# EAGLE design DIY-Cellphone (EAGLE 6.4)
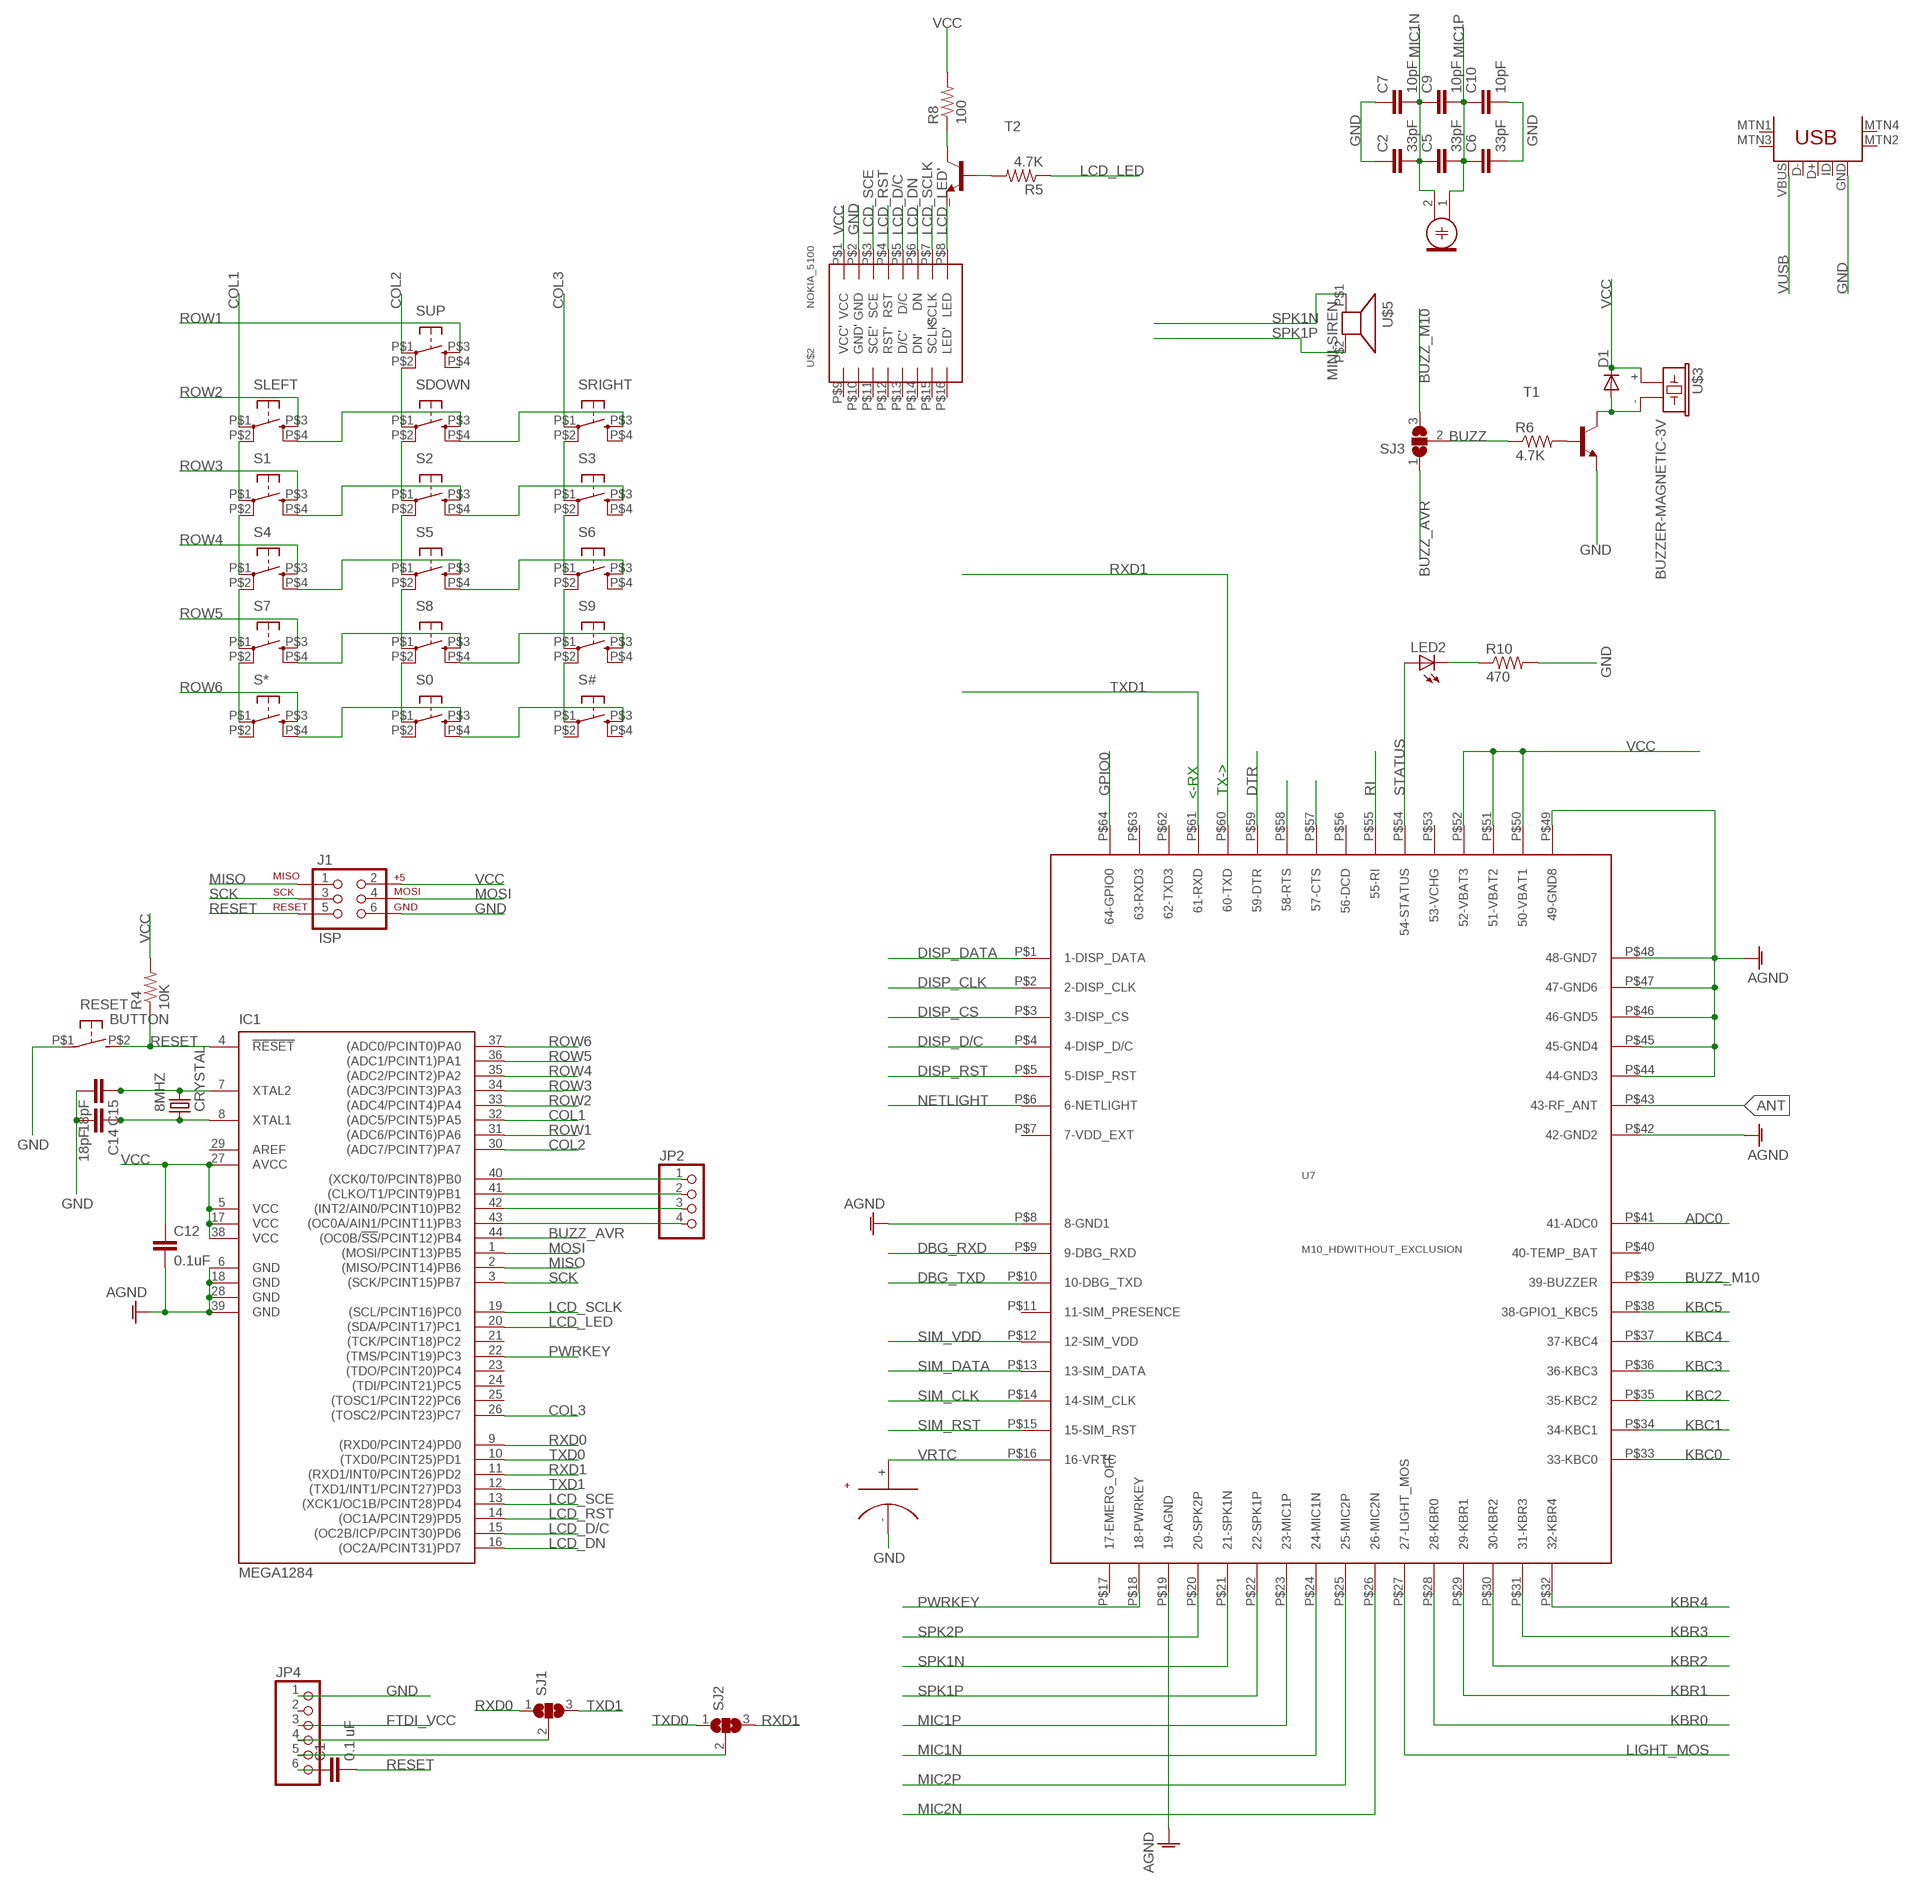
[diagram p0: schematic, sheet 1, part 1 of 2]
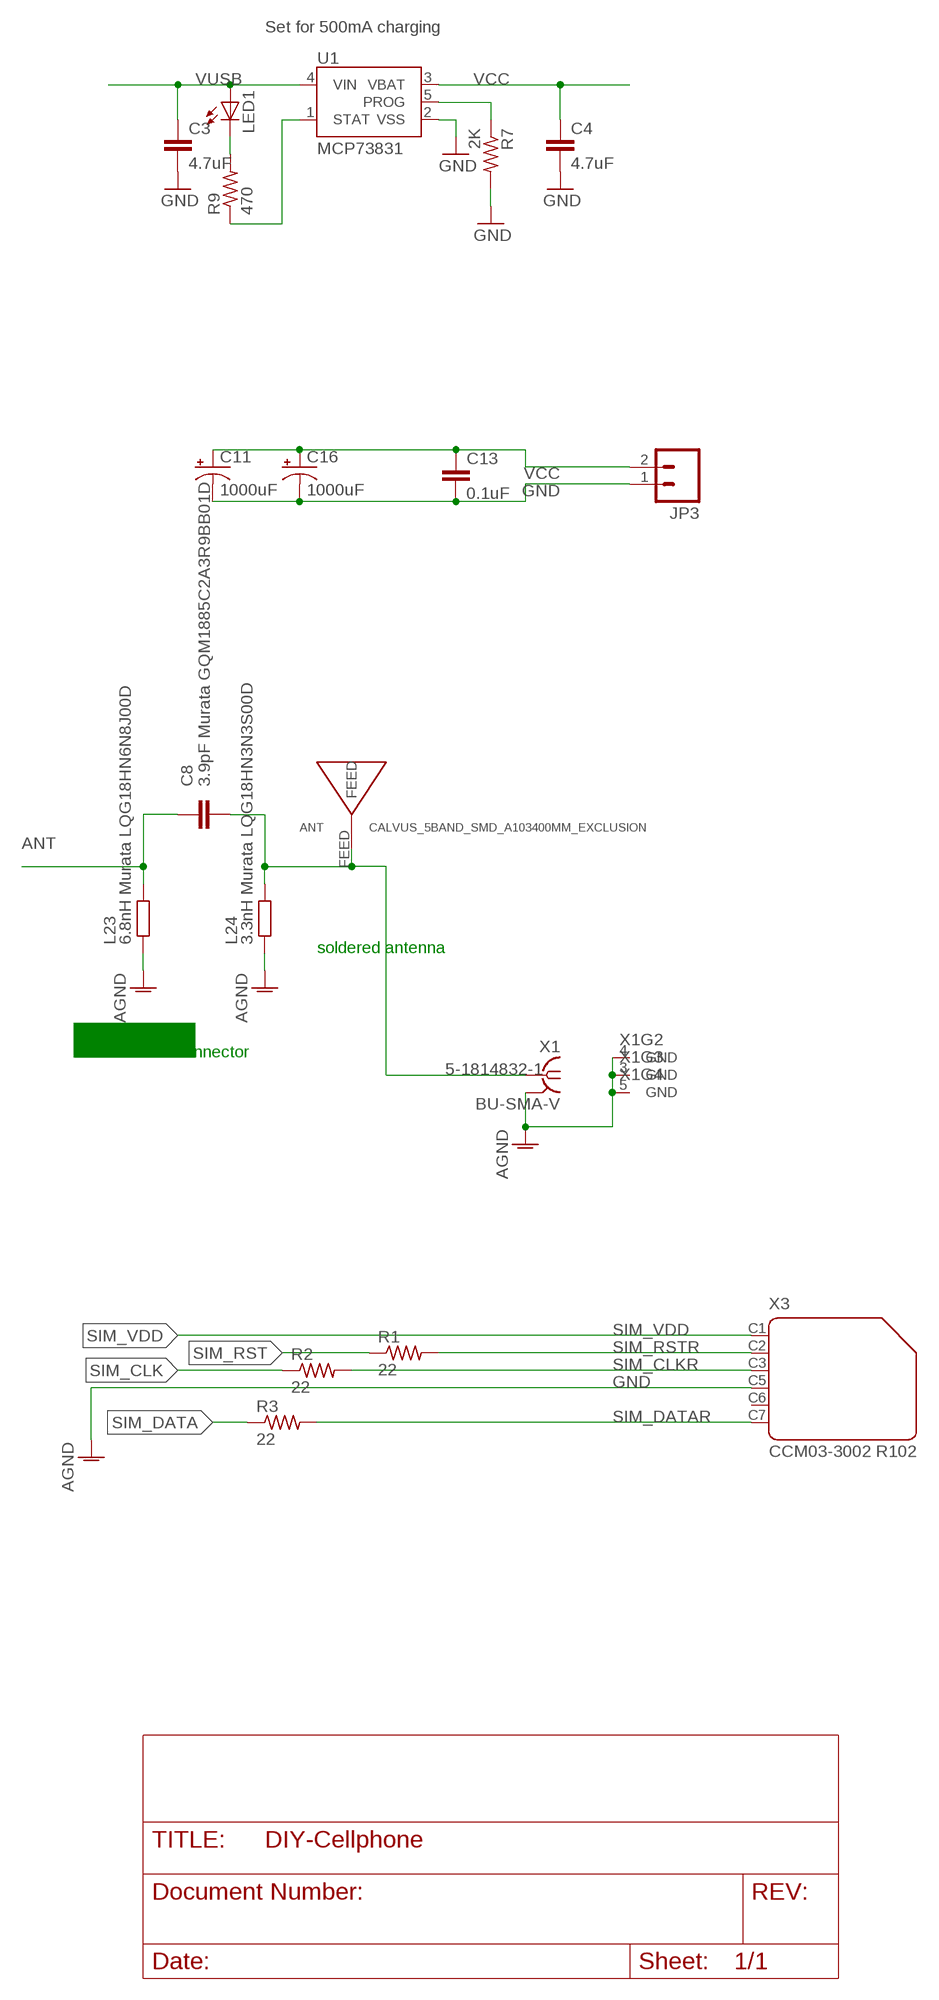
[diagram p1: schematic, sheet 1, part 2 of 2]

## Parts
8MHZ  CRYSTAL  [2-SMD-5X3MM]
ANT  CALVUS_5BAND_SMD_A103400MM_EXCLUSION  [CALVUS_5BAND_SMD_A10340_0MM_EXCLUSION]
C1  0.1 uF  C-EUC1206  [C1206]
C2  33pF  C-EUC1206  [C1206]
C3  4.7uF  C-EUC1206  [C1206]
C4  4.7uF  C-EUC1206  [C1206]
C5  33pF  C-EUC1206  [C1206]
C6  33pF  C-EUC1206  [C1206]
C7  10pF  C-EUC1206  [C1206]
C8  3.9pF Murata GQM1885C2A3R9BB01D  C-EU0603-RND  [C0603-ROUND]
C9  10pF  C-EUC1206  [C1206]
C10  10pF  C-EUC1206  [C1206]
C11  1000uF  CPOL-USD/7343-31R  [D/7343-31R]
C12  0.1uF  C-EUC1206  [C1206]
C13  0.1uF  C-EUC1206  [C1206]
C14  18pF  C-EUC1206  [C1206]
C15  18pF  C-EUC1206  [C1206]
C16  1000uF  CPOL-USD/7343-31R  [D/7343-31R]
D1  DIODE-SOD123  [SOD123]
IC1  MEGA1284  MEGA164P/324P/644P-AU  [TQFP44]
J1  ISP  AVR_SPI_PRG_6NS  [2X3-NS]
JP2  PINHD-1X4  [1X04]
JP3  M02-JST-2MM-SMT  [JST-2-SMD]
JP4  PINHD-1X6/90  [1X06/90]
L23  6.8nH Murata LQG18HN6N8J00D  R-EU_0603-RND  [R0603-ROUND]
L24  3.3nH Murata LQG18HN3N3S00D  R-EU_0603-RND  [R0603-ROUND]
LED1  LEDSMT1206  [1206]
LED2  LEDSMT1206  [1206]
MIC  ELECTRET_MICROPHON-WM-64PC/64PK  [WM-64PC/64PK]
R1  22  R-US_R1206  [R1206]
R2  22  R-US_R1206  [R1206]
R3  22  R-US_R1206  [R1206]
R4  10K  R-US_R1206  [R1206]
R5  4.7K  R-US_R1206  [R1206]
R6  4.7K  R-US_R1206  [R1206]
R7  2K  R-US_R1206  [R1206]
R8  100  R-US_R1206  [R1206]
R9  470  R-US_R1206  [R1206]
R10  470  R-US_R1206  [R1206]
RESET  BUTTON  BUTTON-2  [B3U-1000P]
S0  SWITCH-JLEAD  [BUTTON_6MM_JLEAD]
S1  SWITCH-JLEAD  [BUTTON_6MM_JLEAD]
S2  SWITCH-JLEAD  [BUTTON_6MM_JLEAD]
S3  SWITCH-JLEAD  [BUTTON_6MM_JLEAD]
S4  SWITCH-JLEAD  [BUTTON_6MM_JLEAD]
S5  SWITCH-JLEAD  [BUTTON_6MM_JLEAD]
S6  SWITCH-JLEAD  [BUTTON_6MM_JLEAD]
S7  SWITCH-JLEAD  [BUTTON_6MM_JLEAD]
S8  SWITCH-JLEAD  [BUTTON_6MM_JLEAD]
S9  SWITCH-JLEAD  [BUTTON_6MM_JLEAD]
S#  SWITCH-JLEAD  [BUTTON_6MM_JLEAD]
S*  SWITCH-JLEAD  [BUTTON_6MM_JLEAD]
SDOWN  SWITCH-JLEAD  [BUTTON_6MM_JLEAD]
SJ1  SJ2W  [SJ_2]
SJ2  SJ2W  [SJ_2]
SJ3  SJ2W  [SJ_2]
SLEFT  SWITCH-JLEAD  [BUTTON_6MM_JLEAD]
SRIGHT  SWITCH-JLEAD  [BUTTON_6MM_JLEAD]
SUP  SWITCH-JLEAD  [BUTTON_6MM_JLEAD]
T1  MMBT3904LT1-NPN-SOT23-BEC  [SOT23-BEC]
T2  MMBT3904LT1-NPN-SOT23-BEC  [SOT23-BEC]
U1  MCP73831  [SOT23-5]
U7  M10_HDWITHOUT_EXCLUSION  [M10_HD_WITHOUT_EXCLUSION]
U$1  USB-MINIB-5PIN  [USB-MINIB]
U$2  NOKIA_5100  [NOKIA_5100_SPARKFUN]
U$3  BUZZER-MAGNETIC-3V  [PUI-SMT-0540]
U$4  SUPERCAPPAS  [414-VA5R]
U$5  MINI-SIREN  [SPEAKER-6.4MM]
X1  BU-SMA-V  [BU-SMA-V]
X3  CCM03-3002 R102  CON-AMPHENOL_SIMLOCK-C707_10M006_512_2  [CON-AMPHENOL_C707_10M006_512_2]

## Nets
ADC0: U7.P$41(41-ADC0)
ANT [antenna]: C8.1 L23.2 U7.P$43(43-RF_ANT)
ANTENA [antenna]: ANT.FEED C8.2 L24.2 X1.1
BUZZ: R6.1 SJ3.2
BUZZ_AVR: IC1.44((OC0B/!SS!/PCINT12)PB4) SJ3.1
BUZZ_M10: SJ3.3 U7.P$39(39-BUZZER)
COL1: IC1.32((ADC5/PCINT5)PA5) SLEFT.P$1(P)
COL2: IC1.30((ADC7/PCINT7)PA7) SUP.P$1(P)
COL3: IC1.26((TOSC2/PCINT23)PC7) SRIGHT.P$1(P)
DBG_RXD: U7.P$9(9-DBG_RXD)
DBG_TXD: U7.P$10(10-DBG_TXD)
DISP_CLK: U7.P$2(2-DISP_CLK)
DISP_CS: U7.P$3(3-DISP_CS)
DISP_D/C: U7.P$4(4-DISP_D/C)
DISP_DATA: U7.P$1(1-DISP_DATA)
DISP_RST: U7.P$5(5-DISP_RST)
DTR: U7.P$59(59-DTR)
FTDI_VCC: JP4.3
GND [gnd]: C2.1 C3.2 C4.2 C6.2 C7.1 C10.2 C11.- C12.2 C13.2 C14.2 C15.2 C16.- IC1.6(GND) IC1.18(GND) IC1.28(GND) IC1.39(GND) J1.6 JP3.1 JP4.1 L23.1 L24.1 R7.2 R10.2 RESET.P$1(P) T1.E U1.2(VSS) U7.P$8(8-GND1) U7.P$19(19-AGND) U7.P$42(42-GND2) U7.P$44(44-GND3) U7.P$45(45-GND4) U7.P$46(46-GND5) U7.P$47(47-GND6) U7.P$48(48-GND7) U7.P$49(49-GND8) U$1.GND U$2.P$2(GND) U$4.- X1.2(GND) X1.3(GND) X1.4(GND) X1.5(GND) X3.C5 ; supply symbol labelled AGND
GPIO0: U7.P$64(64-GPIO0)
KBC0: U7.P$33(33-KBC0)
KBC1: U7.P$34(34-KBC1)
KBC2: U7.P$35(35-KBC2)
KBC3: U7.P$36(36-KBC3)
KBC4: U7.P$37(37-KBC4)
KBC5: U7.P$38(38-GPIO1_KBC5)
KBR0: U7.P$28(28-KBR0)
KBR1: U7.P$29(29-KBR1)
KBR2: U7.P$30(30-KBR2)
KBR3: U7.P$31(31-KBR3)
KBR4: U7.P$32(32-KBR4)
LCD_D/C: IC1.15((OC2B/ICP/PCINT30)PD6) U$2.P$5(D/C)
LCD_DN: IC1.16((OC2A/PCINT31)PD7) U$2.P$6(DN)
LCD_LED: IC1.20((SDA/PCINT17)PC1) R5.1
LCD_LED': T2.E U$2.P$8(LED)
LCD_RST: IC1.14((OC1A/PCINT29)PD5) U$2.P$4(RST)
LCD_SCE: IC1.13((XCK1/OC1B/PCINT28)PD4) U$2.P$3(SCE)
LCD_SCLK: IC1.19((SCL/PCINT16)PC0) U$2.P$7(SCLK)
LIGHT_MOS: U7.P$27(27-LIGHT_MOS)
MIC1N: C2.2 C5.1 C7.2 C9.1 MIC.2 U7.P$24(24-MIC1N)
MIC1P: C5.2 C6.1 C9.2 C10.1 MIC.1 U7.P$23(23-MIC1P)
MIC2N: U7.P$26(26-MIC2N)
MIC2P: U7.P$25(25-MIC2P)
MISO: IC1.2((MISO/PCINT14)PB6) J1.1
MOSI: IC1.1((MOSI/PCINT13)PB5) J1.4
N$1: U7.P$57(57-CTS)
N$2: R5.2 T2.B
N$3: R8.1 T2.C
N$4: D1.A T1.C U$3.-
N$5: C1.1 JP4.6
N$6: R6.2 T1.B
N$7: 8MHZ.P$2 C15.1 IC1.7(XTAL2)
N$8: 8MHZ.P$1 C14.1 IC1.8(XTAL1)
N$10: S1.P$1(P) SLEFT.P$2(P1)
N$11: S1.P$2(P1) S4.P$1(P)
N$12: S4.P$2(P1) S7.P$1(P)
N$13: JP4.4 SJ1.2
N$14: SDOWN.P$1(P) SUP.P$2(P1)
N$15: S2.P$1(P) SDOWN.P$2(P1)
N$16: S2.P$2(P1) S5.P$1(P)
N$17: S5.P$2(P1) S8.P$1(P)
N$18: JP4.5 SJ2.2
N$19: S3.P$1(P) SRIGHT.P$2(P1)
N$20: S3.P$2(P1) S6.P$1(P)
N$21: S6.P$2(P1) S9.P$1(P)
N$22: S0.P$4(S1) S#.P$3(S)
N$23: S0.P$3(S) S*.P$4(S1)
N$24: S7.P$4(S1) S8.P$3(S)
N$25: S8.P$4(S1) S9.P$3(S)
N$26: S4.P$4(S1) S5.P$3(S)
N$27: S5.P$4(S1) S6.P$3(S)
N$28: S1.P$4(S1) S2.P$3(S)
N$29: S2.P$4(S1) S3.P$3(S)
N$30: SDOWN.P$3(S) SLEFT.P$4(S1)
N$31: SDOWN.P$4(S1) SRIGHT.P$3(S)
N$32: S7.P$2(P1) S*.P$1(P)
N$33: S0.P$1(P) S8.P$2(P1)
N$34: S9.P$2(P1) S#.P$1(P)
N$35: R9.1 U1.1(STAT)
N$36: LED1.C R9.2
N$37: LED2.C R10.1
N$38: IC1.40((XCK0/T0/PCINT8)PB0) JP2.1
N$39: IC1.41((CLKO/T1/PCINT9)PB1) JP2.2
N$40: IC1.42((INT2/AIN0/PCINT10)PB2) JP2.3
N$41: IC1.43((OC0A/AIN1/PCINT11)PB3) JP2.4
N$43: U7.P$58(58-RTS)
NETLIGHT: U7.P$6(6-NETLIGHT)
PROG: R7.1 U1.5(PROG)
PWRKEY: IC1.22((TMS/PCINT19)PC3) U7.P$18(18-PWRKEY)
RESET: C1.2 IC1.4(!RESET) J1.5 R4.1 RESET.P$2(S)
RI: U7.P$55(55-RI)
ROW1: IC1.31((ADC6/PCINT6)PA6) SUP.P$3(S)
ROW2: IC1.33((ADC4/PCINT4)PA4) SLEFT.P$3(S)
ROW3: IC1.34((ADC3/PCINT3)PA3) S1.P$3(S)
ROW4: IC1.35((ADC2/PCINT2)PA2) S4.P$3(S)
ROW5: IC1.36((ADC1/PCINT1)PA1) S7.P$3(S)
ROW6: IC1.37((ADC0/PCINT0)PA0) S*.P$3(S)
RXD0: IC1.9((RXD0/PCINT24)PD0) SJ1.1
RXD1: IC1.11((RXD1/INT0/PCINT26)PD2) SJ2.3 U7.P$60(60-TXD)
SCK: IC1.3((SCK/PCINT15)PB7) J1.3
SIM_CLK: R2.1 U7.P$14(14-SIM_CLK)
SIM_CLKR: R2.2 X3.C3
SIM_DATA: R3.1 U7.P$13(13-SIM_DATA)
SIM_DATAR: R3.2 X3.C7
SIM_RST: R1.1 U7.P$15(15-SIM_RST)
SIM_RSTR: R1.2 X3.C2
SIM_VDD: U7.P$12(12-SIM_VDD) X3.C1
SPK1N: U7.P$21(21-SPK1N) U$5.P$1
SPK1P: U7.P$22(22-SPK1P) U$5.P$2
SPK2P: U7.P$20(20-SPK2P)
STATUS: LED2.A U7.P$54(54-STATUS)
TXD0: IC1.10((TXD0/PCINT25)PD1) SJ2.1
TXD1: IC1.12((TXD1/INT1/PCINT27)PD3) SJ1.3 U7.P$61(61-RXD)
VCC [power]: C4.1 C11.+ C12.1 C13.1 C16.+ D1.C IC1.5(VCC) IC1.17(VCC) IC1.27(AVCC) IC1.38(VCC) J1.2 JP3.2 R4.2 R8.2 U1.3(VBAT) U7.P$50(50-VBAT1) U7.P$51(51-VBAT2) U7.P$52(52-VBAT3) U$2.P$1(VCC) U$3.+
VRTC: U7.P$16(16-VRTC) U$4.+
VUSB: C3.1 LED1.A U1.4(VIN) U$1.VBUS
Unconnected: IC1.21((TCK/PCINT18)PC2) IC1.23((TDO/PCINT20)PC4) IC1.24((TDI/PCINT21)PC5) IC1.25((TOSC1/PCINT22)PC6) JP4.2 S0.P$2(P1) S3.P$4(S1) S6.P$4(S1) S9.P$4(S1) S#.P$2(P1) S#.P$4(S1) S*.P$2(P1) SRIGHT.P$4(S1) SUP.P$4(S1) U7.P$7(7-VDD_EXT) U7.P$11(11-SIM_PRESENCE) U7.P$17(17-EMERG_OFF) U7.P$40(40-TEMP_BAT) U7.P$53(53-VCHG) U7.P$56(56-DCD) U7.P$62(62-TXD3) U7.P$63(63-RXD3) U$1.D+ U$1.D- U$1.ID U$1.MTN1(MTN2) U$1.MTN2(MTN3) U$1.MTN3(MTN1) U$1.MTN4 U$2.P$9(VCC') U$2.P$10(GND') U$2.P$11(SCE') U$2.P$12(RST') U$2.P$13(D/C') U$2.P$14(DN') U$2.P$15(SCLK') U$2.P$16(LED') X3.C6

## Notes on the sheet
- Set for 500mA charging
- <-RX
- TX->
- soldered antenna
- SMA or U.FL connector

## Power pins joined to a net without a drawn wire
AREF: IC1.29(AREF)

## Library data of the parts
8MHZ = fab:CRYSTAL
ANT = SmartPrj:CALVUS_5BAND_SMD_A10340
C1-C7 C9 C10 C12-C15 = cellphone-rcl:C-EU: CAPACITOR, European symbol
C8 = SmartPrj:C-EU: CAPACITOR, European symbol
C11 C16 = cellphone-rcl:CPOL-US: POLARIZED CAPACITOR, American symbol
D1 = cellphone-diode:DIODE-: DIODE
IC1 = avr-5:MEGA164P/324P/644P-AU
J1 = SparkFun-Connectors:AVR_SPI_PRG_6: AVR ISP 6 Pin This is the reduced ISP connector for AVR programming. Common on Arduino. This footprint will take up less PCB space and can be used with a 10-pin to 6-pin adapter such as SKU: BOB-08508
JP2 = pinhead:PINHD-1X4: PIN HEADER
JP3 = SparkFun-Connectors:M02: Header 2 Standard 2-pin 0.1" header. Use with straight break away headers (SKU : PRT-00116), right angle break away headers (PRT-00553), swiss pins (PRT-00743), machine pins (PRT-00117), and female headers (PRT-00115). Molex polarized connector foot print use with SKU : PRT-08233 with associated crimp pins and housings.
JP4 = pinhead:PINHD-1X6: PIN HEADER
L23 L24 = SmartPrj:R-EU_: RESISTOR, European symbol
LED1 LED2 = cellphone-led:LED: LED OSRAM: - CHIPLED LG R971, LG N971, LY N971, LG Q971, LY Q971, LO R971, LY R971 LH N974, LH R974 LS Q976, LO Q976, LY Q976 LO Q996 - Hyper CHIPLED LW Q18S LB Q993, LB Q99A, LB R99A - SideLED LS A670, LO A670, LY A670, LG A670, LP A670 LB A673, LV A673, LT A673, LW A673 LH A674 LY A675 LS A676, LA A676, LO A676, LY A676, LW A676 LS A679, LY A679, LG A679 - Hyper Micro SIDELED® LS Y876, LA Y876, LO Y876, LY Y876 LT Y87S - SmartLED LW L88C, LW L88S LB L89C, LB L89S, LG L890 LS L89K, LO L89K, LY L89K LS L896, LA L896, LO L896, LY L896 - TOPLED LS T670, LO T670, LY T670, LG T670, LP T670 LSG T670, LSP T670, LSY T670, LOP T670, LYG T670 LG T671, LOG T671, LSG T671 LB T673, LV T673, LT T673, LW T673 LH T674 LS T676, LA T676, LO T676, LY T676, LB T676, LH T676, LSB T676, LW T676 LB T67C, LV T67C, LT T67C, LS T67K, LO T67K, LY T67K, LW E67C LS E67B, LA E67B, LO E67B, LY E67B, LB E67C, LV E67C, LT E67C LW T67C LS T679, LY T679, LG T679 LS T770, LO T770, LY T770, LG T770, LP T770 LB T773, LV T773, LT T773, LW T773 LH T774 LS E675, LA E675, LY E675, LS T675 LS T776, LA T776, LO T776, LY T776, LB T776 LHGB T686 LT T68C, LB T68C - Hyper Mini TOPLED® LB M676 - Mini TOPLED Santana® LG M470 LS M47K, LO M47K, LY M47K Source: http://www.osram.convergy.de LUXEON: - LUMILED® LXK2-PW12-R00, LXK2-PW12-S00, LXK2-PW14-U00, LXK2-PW14-V00 LXK2-PM12-R00, LXK2-PM12-S00, LXK2-PM14-U00 LXK2-PE12-Q00, LXK2-PE12-R00, LXK2-PE12-S00, LXK2-PE14-T00, LXK2-PE14-U00 LXK2-PB12-K00, LXK2-PB12-L00, LXK2-PB12-M00, LXK2-PB14-N00, LXK2-PB14-P00, LXK2-PB14-Q00 LXK2-PR12-L00, LXK2-PR12-M00, LXK2-PR14-Q00, LXK2-PR14-R00 LXK2-PD12-Q00, LXK2-PD12-R00, LXK2-PD12-S00 LXK2-PH12-R00, LXK2-PH12-S00 LXK2-PL12-P00, LXK2-PL12-Q00, LXK2-PL12-R00 Source: www.luxeon.com KINGBRIGHT: KA-3528ASYC Source: www.kingbright.com
MIC = microphon:ELECTRET_MICROPHON-: Electret Condenser Microphone
R1-R10 = cellphone-rcl:R-US_: RESISTOR, American symbol
RESET = cellphone:BUTTON-2
S0 S1-S9 S# S* SDOWN SLEFT SRIGHT SUP = cellphone:SWITCH-JLEAD: Digikey #EG4374CT-ND. SWITCH TACTILE SPST-NO 0.05A 12V. 6.00mm x 6.00mm.
SJ1-SJ3 = jumper:SJ2W: SMD solder JUMPER
T1 T2 = transistor:*-NPN-: NPN Transistror BF959 corrected 2008.03.06
U1 = SparkFun:MCP73831: Microchip's MCP73831 Miniature single cell, fully integrated Li-Ion, Li-polymer charge management controller http://ww1.microchip.com/downloads/en/DeviceDoc/21984a.pdf
U7 = GSM:M10_HD
U$1 = SparkFun-Connectors:USB-MINIB: Mini-USB "B" connector with 5th pin broken out. Created new symbol breaking out 5th "ID" pin in mini/micro USB connector spec. See: http://en.wikipedia.org/wiki/Mini_usb#Cables. Uses same footprint as 4-pin symbol. Also added pins to connect to mounting / shield pads if required (probably not generally needed as signals aren't shielded once they leave the connector).
U$2 = cellphone:NOKIA_5100
U$3 = cellphone:BUZZER-MAGNETIC-3V
U$4 = cellphone:SUPERCAP
U$5 = cellphone:MINI-SIREN
X1 = con-coax:BU-SMA-V: FEMALE SMA CONNECTOR Radiall distributor RS 112-3794; PN: 5-1814832-1
X3 = SmartPrj:CON-AMPHENOL_SIMLOCK-C707_10M006_512_2: C707A SIMLOCK® 2.5 mm with wide solder tails Source: Data sheet <http://www.amphenol.info/downloads/C707_10M006_512_2.pdf>; OC_FARNELL: 1463072; OC_NEWARK: unknown

## Net classes
1 power: width 0.254 mm, drill 0.406 mm, clearance 0.178 mm
2 gnd: width 0.254 mm, drill 0.406 mm, clearance 0.178 mm
3 power usb: width 0.254 mm, drill 0.406 mm, clearance 0.178 mm
4 antenna: clearance 0.61 mm

## Board
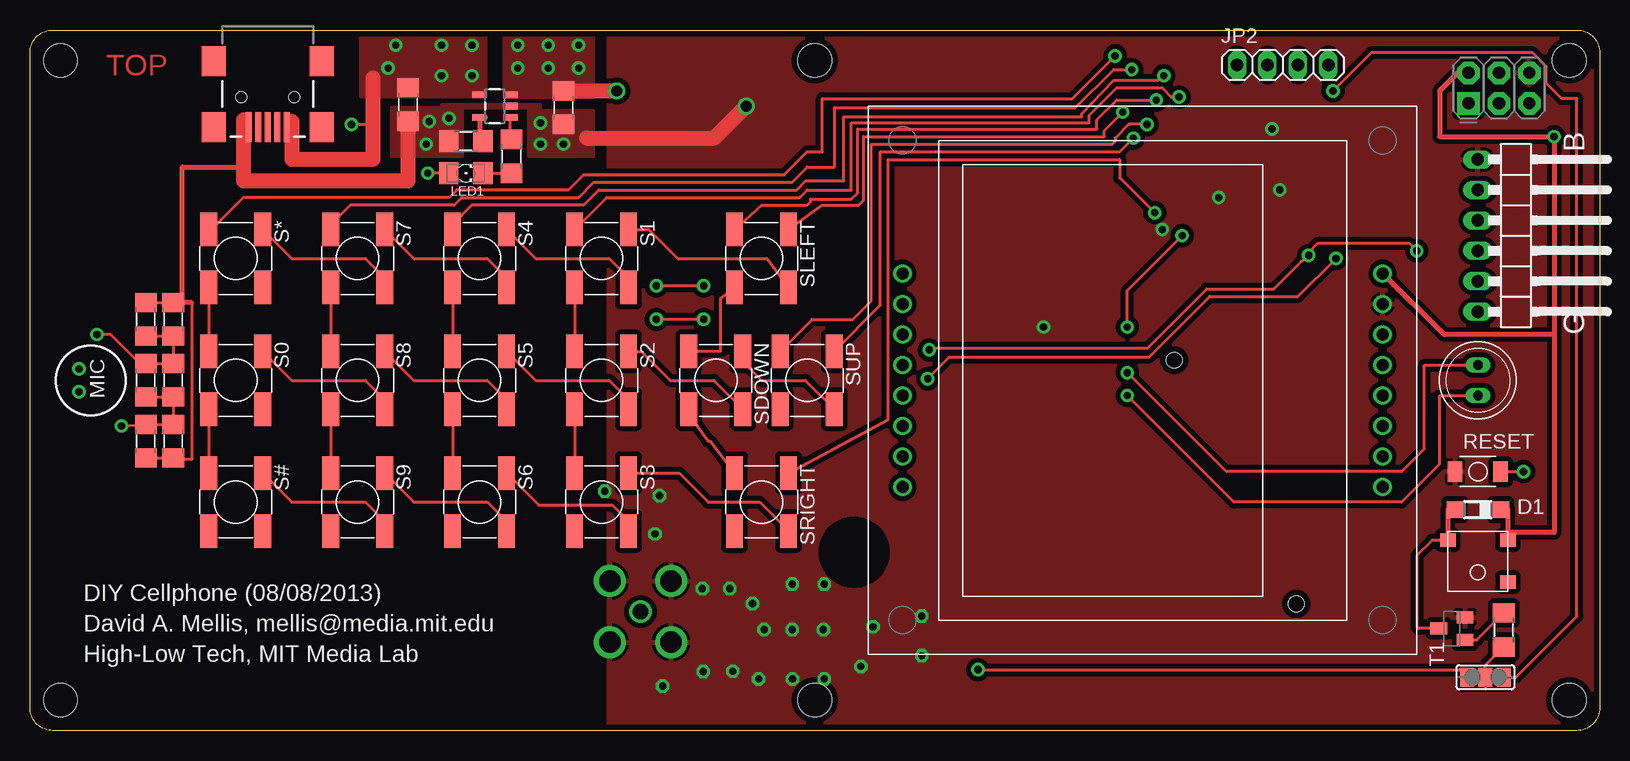
[diagram p2: board, top side]
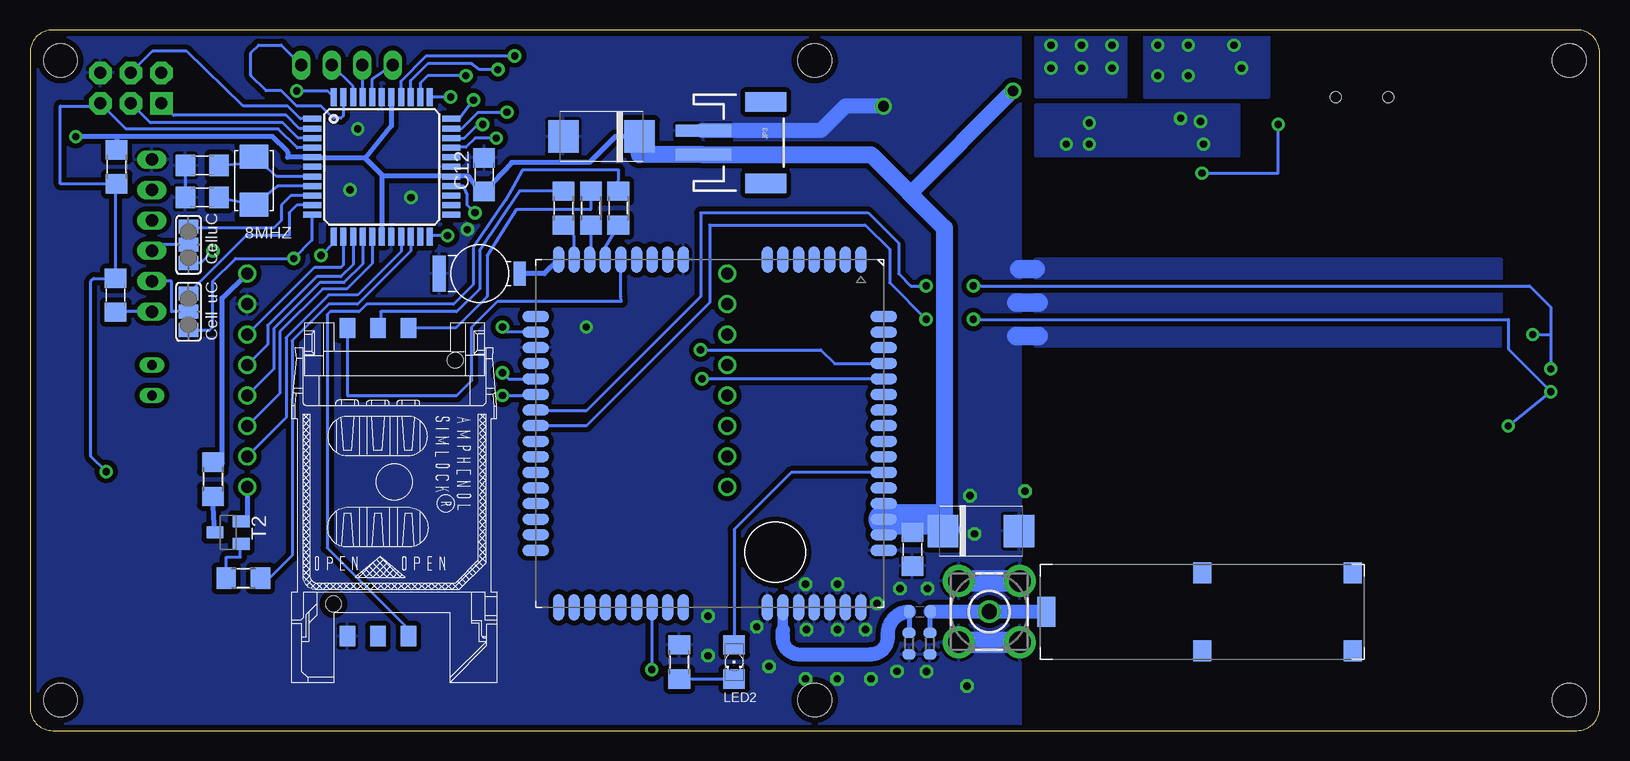
[diagram p3: board, bottom side, seen from below]

Size 130.81 x 58.42 mm. Coordinates in mm from the lower left corner, seen from the top.
Outline: 130.81,56.52 130.81,1.91 arc-90 128.91,0 1.91,0 arc-90 0,1.91 0,56.52 arc-90 1.91,58.42 128.91,58.42 arc-90 130.81,56.52
Copper layers (1*16): Top 0.035mm / dielectric 1.5mm / Bottom 0.035mm
Design rules "default": minimum track width 10mil, minimum drill 22mil, track to track 8mil, track to pad 8mil, pad to pad 8mil, via to via 8mil, smd to smd 8mil, copper to edge 20mil, drill to drill 12mil, minimum pad ring 10mil, minimum via ring 10mil, stop-mask expansion 1mil, vias tented up to drill 30mil, thermal gap 10mil
Holes 2.8 mm at 2.54,55.88 2.54,2.54 128.27,2.54 128.27,55.88 65.41,55.88 65.41,2.54

### Footprints (pad centres in the part's own frame; a part is rotated, then mirrored left to right if it is on the bottom)
2-SMD-5X3MM = smd 2 x 2.4: P$1 -2,0; P$2 2,0
CALVUS_5BAND_SMD_A10340_0MM_EXCLUSION = smd 2.5 x 1.5: FEED 3.95,0.5 | smd 1.75 x 1.5: FIXINGPOINT$1 0.7,26.05; FIXINGPOINT$2 7.22,26.05; FIXINGPOINT$3 0.7,13.49; FIXINGPOINT$4 7.22,13.49
C1206 = smd 1.6 x 1.8: 1 -1.4,0; 2 1.4,0
C0603-ROUND = smd 0.898 x 1.1: 1 -0.889,0; 2 0.889,0
D/7343-31R = smd 2.55 x 2.7: + 3.175,0; - -3.175,0
SOD123 = smd 1.4 x 1.4: A 1.9,0; C -1.9,0
TQFP44 = smd 1.5 x 0.5: 1 -5.8,4; 2 -5.8,3.2; 3 -5.8,2.4; 4 -5.8,1.6; 5 -5.8,0.8; 6 -5.8,0; 7 -5.8,-0.8; 8 -5.8,-1.6; 9 -5.8,-2.4; 10 -5.8,-3.2; 11 -5.8,-4; 23 5.8,-4; 24 5.8,-3.2; 25 5.8,-2.4; 26 5.8,-1.6; 27 5.8,-0.8; 28 5.8,0; 29 5.8,0.8; 30 5.8,1.6; 31 5.8,2.4; 32 5.8,3.2; 33 5.8,4 | smd 0.5 x 1.5: 12 -4,-5.8; 13 -3.2,-5.8; 14 -2.4,-5.8; 15 -1.6,-5.8; 16 -0.8,-5.8; 17 0,-5.8; 18 0.8,-5.8; 19 1.6,-5.8; 20 2.4,-5.8; 21 3.2,-5.8; 22 4,-5.8; 34 4,5.8; 35 3.2,5.8; 36 2.4,5.8; 37 1.6,5.8; 38 0.8,5.8; 39 0,5.8; 40 -0.8,5.8; 41 -1.6,5.8; 42 -2.4,5.8; 43 -3.2,5.8; 44 -4,5.8
2X3-NS = drill 1.016 pad 1.88 square: 1 -2.54,-1.27 | drill 1.016 pad 1.88 octagon: 2 -2.54,1.27; 3 0,-1.27; 4 0,1.27; 5 2.54,-1.27; 6 2.54,1.27
1X04 = drill 1.016 long: 1 -3.81,0; 2 -1.27,0; 3 1.27,0; 4 3.81,0
JST-2-SMD = smd 1 x 4.6: 1 -1,-3.7; 2 1,-3.7 | smd 1.6 x 3.4: NC1 -3.4,1.5; NC2 3.4,1.5
1X06/90 = drill 1.016 long: 1 -6.35,-3.81; 2 -3.81,-3.81; 3 -1.27,-3.81; 4 1.27,-3.81; 5 3.81,-3.81; 6 6.35,-3.81
R0603-ROUND = smd 0.898 x 1.1: 1 -0.889,0; 2 0.889,0
1206 = smd 1.6 x 1.803: A -1.422,0; C 1.422,0
WM-64PC/64PK = drill 0.6 pad 1: 1 -1,0.95; 2 -1,-0.95
R1206 = smd 1.6 x 1.803: 1 -1.422,0; 2 1.422,0
B3U-1000P = smd 1.2 x 1.7: P$1 -1.9,0; P$2 1.9,0
BUTTON_6MM_JLEAD = smd 2.794 x 1.4: P$1 -2.413,2.25; P$2 2.413,2.25; P$3 -2.413,-2.25; P$4 2.413,-2.25
SJ_2 = smd 1.168 x 1.6: 1 -1.524,0; 2 0,0; 3 1.524,0
SOT23-BEC = smd 1 x 1.4: B -0.95,-1.1; C 0,1.1; E 0.95,-1.1
SOT23-5 = smd 0.55 x 1.2: 1 -0.95,-1.3; 2 0,-1.3; 3 0.95,-1.3; 4 0.95,1.3; 5 -0.95,1.3
M10_HD_WITHOUT_EXCLUSION = smd 2.2 x 0.9: P$1 0,27.1; P$2 0,25.8; P$3 0,24.5; P$4 0,23.2; P$5 0,21.9; P$6 0,20.6; P$7 0,19.3; P$8 0,12.3; P$9 0,11; P$10 0,9.7; P$11 0,8.4; P$12 0,7.1; P$13 0,5.8; P$14 0,4.5; P$15 0,3.2; P$16 0,1.9; P$33 29,1.9; P$34 29,3.2; P$35 29,4.5; P$36 29,5.8; P$37 29,7.1; P$38 29,8.4; P$39 29,9.7; P$40 29,11; P$41 29,12.3; P$42 29,19.3; P$43 29,20.6; P$44 29,21.9; P$45 29,23.2; P$46 29,24.5; P$47 29,25.8; P$48 29,27.1 | smd 0.9 x 2.2: P$17 4.75,0; P$18 6.05,0; P$19 7.35,0; P$20 8.65,0; P$21 9.95,0; P$22 11.25,0; P$23 12.55,0; P$24 13.85,0; P$25 15.15,0; P$26 16.45,0; P$27 17.75,0; P$28 19.05,0; P$29 20.35,0; P$30 21.65,0; P$31 22.95,0; P$32 24.25,0; P$49 24.25,29; P$50 22.95,29; P$51 21.65,29; P$52 20.35,29; P$53 19.05,29; P$54 17.75,29; P$55 16.45,29; P$56 15.15,29; P$57 13.85,29; P$58 12.55,29; P$59 11.25,29; P$60 9.95,29; P$61 8.65,29; P$62 7.35,29; P$63 6.05,29; P$64 4.75,29
USB-MINIB = smd 2.5 x 0.5: D+ 2.5,0; D- 2.5,0.8; GND 2.5,-1.6; ID 2.5,-0.8; VBUS 2.5,1.6 | smd 2.5 x 2: MTN1 -3,4.5; MTN2 2.5,4.5; MTN3 -3,-4.5; MTN4 2.5,-4.5 | hole 0.9: 0,2.2; 0,-2.2
NOKIA_5100_SPARKFUN = drill 1: P$1 -8.89,20; P$2 -6.35,20; P$3 -3.81,20; P$4 -1.27,20; P$5 1.27,20; P$6 3.81,20; P$7 6.35,20; P$8 8.89,20; P$9 -8.89,-20; P$10 -6.35,-20; P$11 -3.81,-20; P$12 -1.27,-20; P$13 1.27,-20; P$14 3.81,-20; P$15 6.35,-20; P$16 8.89,-20
PUI-SMT-0540 = smd 1.3 x 1.1: + -2.5,0; - 2.5,0; DUMMY -2.5,3.5
414-VA5R = smd 1 x 2: + -3.35,0 | smd 1.1 x 3: - 3.35,0
SPEAKER-6.4MM = drill 0.8 long: P$1 -1.27,0; P$2 1.27,0
BU-SMA-V = drill 1.27: 1 0,0 | drill 1.778: 2 -2.55,2.55; 3 2.55,2.55; 4 2.55,-2.55; 5 -2.55,-2.55
CON-AMPHENOL_C707_10M006_512_2 = smd 1.7 x 1.3: C1 -12.85,-3.915; C2 -12.85,-1.375; C3 -12.85,1.165; C5 12.85,-3.915; C6 12.85,-1.375; C7 12.85,1.165 | hole 1.3: 10.16,-5.08; -10.16,5.08

### Placement (x,y rotation side)
8MHZ  112.14,45.85 90 bottom
ANT  46.63,13.86 270 bottom
C1  123.68,36.31 90 bottom
C2  9.65,24.13 90 top
C3  31.5,52.2 270 top
C4  44.45,51.94 270 top
C5  9.65,29.21 90 top
C6  9.65,34.29 90 top
C7  11.94,24.13 90 top
C8  56.66,9.92 0 bottom
C9  11.94,29.21 90 top
C10  11.94,34.29 90 top
C11  83.19,49.53 0 bottom
C12  92.96,46.35 90 bottom
C13  57.28,15.11 270 bottom
C14  116.46,44.45 180 bottom
C15  116.46,47.12 180 bottom
C16  51.56,16.64 180 bottom
D1  120.65,18.41 180 top
IC1  101.49,47.01 0 bottom
J1  122.41,53.58 0 top
JP2  104.39,55.5 0 top
JP3  70.99,49.02 270 bottom
JP4  124.46,41.27 270 top
L23  57.55,7.25 90 bottom
L24  55.82,7.25 90 bottom
LED1  36.32,46.48 0 top
LED2  72.14,5.71 270 bottom
MIC  5.08,29.21 0 top
R1  86.36,43.56 90 bottom
R2  84.07,43.56 90 bottom
R3  81.79,43.56 90 bottom
R4  123.59,47.01 90 bottom
R5  113.03,12.7 180 bottom
R6  122.81,8.38 90 top
R7  36.32,49.15 180 top
R8  115.57,20.95 90 bottom
R9  40.13,47.88 270 top
R10  76.71,5.71 90 bottom
RESET  120.65,21.59 0 top
S0  17.14,29.21 270 top
S1  47.62,39.37 270 top
S2  47.62,29.21 270 top
S3  47.62,19.05 270 top
S4  37.47,39.37 270 top
S5  37.47,29.21 270 top
S6  37.47,19.05 270 top
S7  27.3,39.37 270 top
S8  27.3,29.21 270 top
S9  27.3,19.05 270 top
S#  17.14,19.05 270 top
S*  17.14,39.37 270 top
SDOWN  57.15,29.21 270 top
SJ1  117.6,40.51 270 bottom
SJ2  117.6,34.92 270 bottom
SJ3  121.28,4.45 180 top
SLEFT  60.96,39.37 270 top
SRIGHT  60.96,19.05 270 top
SUP  64.77,29.21 270 top
T1  118.49,8.51 90 top
T2  114.3,16.51 90 bottom
U1  38.73,52.07 90 top
U7  88.67,39.27 270 bottom
U$1  19.81,52.83 270 top
U$2  92.71,29.21 270 top
U$3  120.65,15.88 180 top
U$4  93.34,38.1 180 bottom
U$5  120.65,29.21 270 top
X1  50.87,9.92 0 bottom
X3  100.44,20.72 270 bottom

### Tracks (layer width: path | path; a pad name or v marks a point on that pad's centre or on a via)
ANT
  Bottom 0.406: C8.1 L23.2
  Bottom 0.889: 68.06,8.4 U7.P$43
  Bottom 1.168: 68.06,8.4 68.06,7.89 arc-90 66.92,6.37 60.73,6.37 arc-90 59.33,7.76 59.33,8.02 arc90 C8.1
ANTENA
  Bottom 0.406: 55.52,9.71 C8.2 55.77,8.14 L24.2
  Bottom 1.168: ANT.FEED arc-90 46.27,9.92 X1.1 C8.2
BUZZ
  Top 0.254: SJ3.2 121.28,5.44 R6.1
BUZZ_AVR  (via drill 0.6)
  Top 0.254: v108.58,53.34 111.76,56.52 125.22,56.52 126.36,55.37 126.36,53.98 127.64,52.7 128.91,52.7 128.91,9.53 123.83,4.45 SJ3.1
  Bottom 0.254: v108.58,53.34 106.03,53.34 IC1.44
BUZZ_M10  (via drill 0.6)
  Top 0.254: v78.99,5.08 119.13,5.08 SJ3.3
  Bottom 0.254: U7.P$39 78.99,10.27 v78.99,5.08
COL1  (via drill 0.6)
  Top 0.254: SLEFT.P$1 66.04,43.81 69.05,43.81 69.47,44.23 69.47,49.53 89.53,49.53 89.53,50.04 v91.06,51.56
  Bottom 0.254: IC1.32 94.83,50.21 93.47,51.56 v91.06,51.56
COL2  (via drill 0.6)
  Top 0.254: SUP.P$1 70.87,35.47 70.87,48.26 90.81,48.26 v91.95,49.4
  Bottom 0.254: v91.95,49.4 93.73,49.4 94.49,48.64 95.63,48.64 95.67,48.61 IC1.30
COL3  (via drill 0.6)
  Top 0.254: SRIGHT.P$1 71.5,25.94 71.5,47.62 90.81,47.62 90.81,46.1 v93.73,43.18
  Bottom 0.254: v93.73,43.18 94.36,43.81 94.36,44.7 94.68,45.41 IC1.26
GND  (via drill 0.6, 0.61, 0.9)
  Top 0.254: C2.1 C7.1 11.94,22.61 13.46,22.61 13.46,35.69 C10.2 C6.2 | U$1.GND 17.78,50.93
  Top 0.406: 13.46,35.69 12.7,35.69 12.7,46.99 17.7,46.99 17.78,50.93
  Top 1.27: 17.78,50.93 17.78,45.85 31.5,45.85 C3.2 | 46.35,49.4 57.02,49.4 v59.69,52.07
  Bottom 0.254: C15.2 C14.2
  Bottom 1.27: v59.69,52.07 62.87,52.07 64.9,50.04 74.8,50.04
  Bottom 1.524: 46.99,38.48 48.39,38.48 | 46.74,35.69 48.64,35.69 | 46.74,32.89 48.64,32.89
  Bottom 1.778: X1.5 X1.4 | X1.2 X1.3
  other vias: 66.11,8.42 63.52,8.42 60.22,10.58 61.18,8.42 66.19,4.31 63.54,4.31 60.73,4.31 58.57,4.94 70.25,8.65 69.23,5.35 58.31,11.83 52.72,3.7 56.1,4.92 52.09,16.4 74.31,6.24 74.31,9.54 66.19,12.21 63.52,12.21 56.03,11.83 52.47,19.57 47.9,19.95 99.06,44.45 103.5,50.16 104.14,45.09 94.36,41.78 84.45,33.66 33.27,50.8 34.92,51.05 33.02,48.9 42.55,48.9 42.55,50.67 44.45,48.9
  pour Bottom (isolate 0.406): 130.81,58.42 130.81,0 48.26,0 48.26,58.42
  pour Top (isolate 0.406): 48.26,58.42 130.81,58.42 130.81,0 48.26,0
  pour Bottom (isolate 0.406): 8.26,36.45 46.99,36.45 46.99,34.92 8.26,34.92
  pour Bottom (isolate 0.406): 8.26,33.66 46.99,33.66 46.99,32.13 8.26,32.13
  pour Bottom (isolate 0.406): 8.26,39.24 46.99,39.24 46.99,37.72 8.26,37.72
  pour Top (no thermals): 36.07,51.94 41.53,51.94 41.53,47.88 46.99,47.88 46.99,51.69 42.55,51.69 42.55,52.2 34.29,52.2 34.29,51.94 30.1,51.94 30.1,47.88 36.07,47.88
  pour Bottom: 30.1,47.88 46.99,47.88 46.99,52.2 30.1,52.2
LCD_D/C
  Bottom 0.254: IC1.15 103.09,38.89 104.65,37.34 106.68,37.34 110.49,33.53 110.49,30.16 U$2.P$5
LCD_DN
  Bottom 0.254: IC1.16 102.29,38.93 104.39,36.83 106.43,36.83 109.98,33.27 109.98,28.13 U$2.P$6
LCD_LED
  Bottom 0.254: IC1.20 99.09,39.97 103.5,35.56 105.92,35.56 108.97,32.51 108.97,14.61 110.87,12.7 R5.1
LCD_LED'
  Bottom 0.254: 112.71,17.46 T2.E
  Bottom 0.406: U$2.P$8 112.71,17.46
LCD_RST
  Bottom 0.254: IC1.14 103.89,38.86 104.9,37.85 106.93,37.85 111,33.78 111,32.19 U$2.P$4
LCD_SCE
  Bottom 0.254: IC1.13 104.69,38.82 104.9,38.61 107.12,38.61 U$2.P$3
LCD_SCLK
  Bottom 0.254: IC1.19 99.89,39.94 103.5,36.32 105.92,36.32 109.47,32.77 109.47,26.1 U$2.P$7
MIC1N  (via drill 0.6)
  Top 0.254: C5.1 C9.1 C7.2 C2.2 v7.62,25.4 | v56.13,34.29 v52.2,34.29
  Bottom 0.254: v56.13,34.29 59.18,37.34 59.18,40.13 61.21,42.16 74.17,42.16 74.17,35.69 84.45,25.4 88.64,25.4 U7.P$24 | v52.2,34.29 7.62,34.29 7.62,31.8 MIC.2 v7.62,25.4
MIC1P  (via drill 0.6)
  Top 0.254: C6.1 C10.1 C9.2 C5.2 9.14,30.61 6.73,33.02 v5.59,33.02 | v56.13,37.08 v52.2,37.08
  Bottom 0.254: v56.13,37.08 57.4,37.08 58.42,38.1 58.42,40.64 60.96,43.18 74.93,43.18 74.93,36.2 84.45,26.67 88.61,26.67 U7.P$23 | v52.2,37.08 5.84,37.08 4.06,35.31 4.06,33.02 | 4.06,33.02 4.06,30.18 MIC.1 | v5.59,33.02 4.06,33.02
MISO
  Bottom 0.254: IC1.2 108.37,50.21 109.47,51.31 118.87,51.31 J1.1
MOSI
  Bottom 0.254: IC1.1 108.28,51.01 109.35,52.07 113.03,52.07 117.73,56.64 120.61,56.64 J1.4
N$2
  Bottom 0.254: R5.2 114.45,14.48 113.28,14.48 113.28,15.56 T2.B
N$3
  Bottom 0.254: T2.C 115.4,16.36
  Bottom 0.406: 115.4,16.36 R8.1
N$4
  Top 0.254: T1.C 115.7,8.51 115.57,8.64 115.57,14.61 116.84,15.88 U$3.-
  Top 0.406: D1.A 118.15,18.41 U$3.-
N$5
  Bottom 0.254: JP4.6 123.68,34.92 C1.1
N$6
  Top 0.254: T1.B 120.56,7.56 R6.2
N$7
  Bottom 0.254: IC1.7 110.25,46.21 8MHZ.P$2 111.51,47.37 C15.1
N$8
  Bottom 0.254: IC1.8 110.2,45.41 8MHZ.P$1 C14.1
N$10
  Top 0.254: S1.P$1 51.56,41.78 53.98,39.37 61.43,39.37 SLEFT.P$2
N$11
  Top 0.254: S4.P$1 42.13,39.37 48.26,39.37 49.88,37.76 S1.P$2
N$12
  Top 0.254: S7.P$1 31.97,39.37 38.1,39.37 39.72,37.76 S4.P$2
N$13
  Bottom 0.254: SJ1.2 119.89,40.51 JP4.4
N$14
  Top 0.254: SDOWN.P$1 59.4,30.77 60.96,29.21 64.61,29.21 SUP.P$2
N$15
  Top 0.254: S2.P$1 50.93,31.62 53.34,29.21 56.99,29.21 SDOWN.P$2
N$16
  Top 0.254: S5.P$1 42.13,29.21 48.26,29.21 49.88,27.59 S2.P$2
N$17
  Top 0.254: S8.P$1 31.97,29.21 38.1,29.21 39.72,27.59 S5.P$2
N$18
  Bottom 0.254: SJ2.2 119,34.92 119,37.47 JP4.5
N$19
  Top 0.254: S3.P$1 54.1,21.46 56.52,19.05 60.8,19.05 SRIGHT.P$2
N$20
  Top 0.254: S6.P$1 42.38,18.8 48.51,18.8 49.88,17.43 S3.P$2
N$21
  Top 0.254: S9.P$1 31.97,19.05 38.1,19.05 39.72,17.43 S6.P$2
N$22
  Top 0.254: S0.P$4 S#.P$3
N$23
  Top 0.254: S*.P$4 S0.P$3
N$24
  Top 0.254: S7.P$4 S8.P$3
N$25
  Top 0.254: S8.P$4 S9.P$3
N$26
  Top 0.254: S4.P$4 S5.P$3
N$27
  Top 0.254: S5.P$4 S6.P$3
N$28
  Top 0.254: S1.P$4 S2.P$3
N$29
  Top 0.254: S2.P$4 S3.P$3
N$30
  Top 0.254: SLEFT.P$4 57.53,36.03 57.53,31.62 SDOWN.P$3
N$31
  Top 0.254: SDOWN.P$4 54.9,26.38 56.52,24.13 56.68,24.13 SRIGHT.P$3
N$32
  Top 0.254: S*.P$1 21.81,39.37 27.94,39.37 29.55,37.76 S7.P$2
N$33
  Top 0.254: S0.P$1 21.81,29.21 27.94,29.21 29.55,27.59 S8.P$2
N$34
  Top 0.254: S#.P$1 21.81,19.05 27.94,19.05 29.55,17.43 S9.P$2
N$35
  Top 0.254: R9.1 40.03,49.3 U1.1
N$36
  Top 0.254: LED1.C 40.13,46.48 R9.2
N$37
  Bottom 0.254: LED2.C R10.1
N$38
  Bottom 0.254: IC1.40 102.29,54.3 JP2.1
N$39
  Bottom 0.254: IC1.41 103.09,54.96 JP2.2
N$40
  Bottom 0.254: IC1.42 103.89,53.73 JP2.3
N$41
  Bottom 0.254: IC1.43 104.69,51.26 104.9,51.05 105.54,51.05 106.55,52.07 108.58,52.07 109.86,53.34 111.12,53.34 112.39,54.61 112.39,56.52 111.76,57.15 109.86,57.15 JP2.4
PROG
  Top 0.406: U1.5 37.47,51.12 | 37.95,51.12 37.47,51.12 | 37.47,51.12 37.47,48.9 R7.1
PWRKEY  (via drill 0.6)
  Top 0.254: v91.44,33.66 91.44,36.7 v96.01,41.27
  Bottom 0.254: U7.P$18 91.01,33.22 v91.44,33.66 | v96.01,41.27 97.42,41.27 IC1.22
RESET  (via drill 0.6)
  Top 0.254: RESET.P$2 v124.46,21.59
  Bottom 0.254: IC1.4 108.55,48.61 110.11,50.16 122.81,50.16 J1.5 124.95,52.07 128.27,52.07 128.27,45.58 R4.1 123.68,45.49 C1.2 125.49,37.71 125.73,37.47 125.73,22.86 v124.46,21.59
ROW1  (via drill 0.6)
  Top 0.254: SUP.P$3 65.19,34.29 68.58,34.29 70.1,35.81 70.1,48.9 90.17,48.9 90.42,49.15 90.42,49.4 91.57,50.55 v93.09,50.55
  Bottom 0.254: IC1.31 94.61,49.41 93.47,50.55 v93.09,50.55
ROW2  (via drill 0.6)
  Top 0.254: SLEFT.P$3 60.96,43.81 64.77,43.81 65.06,44.1 65.06,44.32 68.45,44.32 68.96,44.83 68.96,50.16 88.9,50.16 88.9,50.93 90.55,52.58 v93.85,52.58
  Bottom 0.254: v93.85,52.58 95,51.05 95.64,51.05 IC1.33
ROW3  (via drill 0.6)
  Top 0.254: S1.P$3 48.04,44.45 64.14,44.45 64.77,45.09 68.45,45.09 68.45,50.67 88.27,50.67 88.27,51.31 90.55,53.59 94.36,53.59 95.12,52.83 v95.76,52.83
  Bottom 0.254: v95.76,52.83 97.47,52.83 IC1.34
ROW4  (via drill 0.6)
  Top 0.254: v94.49,54.61 93.98,54.23 90.3,54.23 87.63,51.44 87.63,51.18 67.82,51.18 67.82,45.85 64.64,45.85 63.88,45.09 47.41,45.09 46.14,43.81 36.83,43.81 35.22,42.2 S4.P$3
  Bottom 0.254: 98.42,52.94 IC1.35 98.3,53.98 97.66,54.61 v94.49,54.61
ROW5  (via drill 0.6)
  Top 0.254: v91.82,55.12 90.3,55.12 87.12,51.94 67.06,51.94 67.06,46.99 64.77,46.99 63.5,45.72 46.99,45.72 45.72,44.45 35.98,44.45 35.34,43.81 26.67,43.81 25.05,42.2 S7.P$3
  Bottom 0.254: v91.82,55.12 93.34,55.12 93.98,55.63 97.66,55.63 99.09,54.2 IC1.36
ROW6  (via drill 0.6)
  Top 0.254: v90.42,56.26 86.87,52.7 66.04,52.7 66.04,48.26 64.77,48.26 62.87,46.35 46.14,46.35 44.87,45.09 35.56,45.09 34.92,44.45 17.78,44.45 15.11,41.78 S*.P$3
  Bottom 0.254: IC1.37 99.89,54.16 97.79,56.26 v90.42,56.26
RXD0
  Bottom 0.254: IC1.9 109.06,44.61 109.86,43.81 109.86,42.55 110.49,41.91 117.47,41.91 SJ1.1
RXD1  (via drill 0.6)
  Top 0.254: v74.8,29.34 76.58,31.11 93.22,31.11 98.3,36.2 105.66,36.2 v108.84,39.37
  Bottom 0.254: IC1.11 107.31,42.98 107.31,40.89 v108.84,39.37 113.67,39.37 115.57,37.47 115.57,33.66 115.82,33.4 SJ2.3 | v74.8,29.34 59.68,29.34 U7.P$60
SCK
  Bottom 0.254: IC1.3 108.46,49.41 109.73,50.67 120.77,50.67 J1.3
SIM_CLK
  Bottom 0.254: R2.1 84.07,39.37 U7.P$14
SIM_CLKR
  Bottom 0.254: R2.2 84.1,43.43 90.3,43.43 92.71,39.62 92.71,36.2 95.33,33.57 X3.C3
SIM_DATA
  Bottom 0.254: R3.1 82.86,40.3 U7.P$13
SIM_DATAR
  Bottom 0.254: R3.2 81.76,46.74 89.79,46.74 90.55,45.34 91.19,44.2 93.85,40.26 93.85,37.21 95.5,35.56 102.74,35.56 103.38,34.92 105.79,34.92 106.05,34.67 106.05,15.24 99.28,8.47 X3.C7
SIM_RST
  Bottom 0.254: U7.P$15 85.47,41.24 R1.1
SIM_RSTR
  Bottom 0.254: R1.2 90.02,44.98 93.34,40.01 93.34,36.83 95.25,34.92 101.6,34.92 101.6,33.66 101.73,33.66 X3.C2
SIM_VDD
  Bottom 0.254: X3.C1 104.36,27.94 95.25,27.94 93.98,29.21 93.98,33.66 91.82,35.81 81.53,35.81 81.56,36.23 U7.P$12
SPK1N  (via drill 0.6)
  Top 0.254: v91.44,29.84 99.69,21.59 114.3,21.59 116.2,23.5 116.2,30.48 U$5.P$1
  Bottom 0.254: v91.44,29.84 90.92,29.32 U7.P$21
SPK1P  (via drill 0.6)
  Top 0.254: v91.44,27.94 100.33,19.05 114.3,19.05 117.47,22.23 117.47,27.94 U$5.P$2
  Bottom 0.254: v91.44,27.94 88.75,27.94 U7.P$22
STATUS
  Bottom 0.254: U7.P$54 67.38,21.52 72.14,16.76 LED2.A
TXD0
  Bottom 0.254: IC1.10 108.59,43.81 109.22,43.18 109.22,41.27 112.78,41.27 SJ2.1
TXD1  (via drill 0.6)
  Top 0.254: v74.93,31.75 75.06,31.88 93.09,31.88 98.04,36.83 103.63,36.83 105.92,39.12 v106.55,39.62 106.55,39.88 107.31,40.64 114.94,40.64 v115.57,40.01
  Bottom 0.254: IC1.12 105.49,40.69 v106.55,39.62 | v74.93,31.75 64.9,31.75 63.75,30.61 59.68,30.61 U7.P$61 | v115.57,40.01 116.59,38.99 SJ1.3
VCC  (via drill 0.6, 0.9)
  Top 0.406: 127,33.02 v127,49.53 117.47,49.53 117.47,53.34 118.98,54.85 J1.2 | 127,33.02 117.86,33.02 U$2.P$1 | 44.45,53.02 C4.1 | 127,33.02 127,16.51 123.15,16.51 | D1.C 123.15,18.41 123.15,16.51 | 123.15,16.51 U$3.+
  Top 1.27: C4.1 48.77,53.34 v48.9,53.34
  Bottom 0.254: 106.84,47.75 IC1.5 | 101.49,46.37 101.49,46.23 | IC1.27 95.8,46.23
  Bottom 0.406: IC1.38 100.69,50.44 102.87,47.75 | 102.87,47.75 106.84,47.75 | R8.2 114.94,22.86 114.81,22.23 114.81,36.07 U$2.P$1 | C11.+ 82.04,49.53 84.2,47.37 90.67,47.37 C12.1 93.47,45.08 94.23,46.23 95.67,46.23 IC1.27 | 102.87,47.75 101.49,46.37 | IC1.17 101.49,46.23 95.8,46.23 | IC1.5 109.35,47.81 109.35,48.26 110.62,49.53 123.59,49.53 | U7.P$52 U7.P$51 U7.P$50 | 123.59,49.53 R4.2 | 123.59,49.53 v127,49.53
  Bottom 1.27: v48.9,53.34 57.4,44.83 57.4,44.7 54.61,41.91
  Bottom 1.422: C11.+ 80.03,48.02 JP3.2 60.72,48.02 54.61,41.91 54.61,16.76 C16.+ | C13.1 58.39,17.62 U7.P$51
  Bottom 2.54: 54.61,16.76 55.47,17.62 U7.P$51
  other vias: 40.64,57.15 43.18,57.15 45.72,57.15 40.64,55.24 43.18,55.24 45.72,55.24
  pour Top (isolate 0.254, no thermals): 39.5,52.83 46.99,52.83 46.99,58.42 39.5,58.42
  pour Bottom (isolate 0.254, no thermals): 39.5,52.83 46.99,52.83 46.99,58.42 39.5,58.42
VRTC
  Bottom 0.406: U7.P$16 87.94,38.1 U$4.+
VUSB  (via drill 0.6)
  Top 0.254: LED1.A v33.15,46.48 | v26.8,50.55 28.57,50.55 28.57,50.8 | 21.84,47.62 21.84,47.68
  Top 0.406: 21.84,47.62 21.41,47.8 | 21.84,50.8 U$1.VBUS
  Top 1.27: 28.57,54.41 28.57,50.8 28.57,47.62 21.84,47.62 | 21.84,47.68 21.84,50.8
  Bottom 0.254: v33.15,46.48 26.8,46.48 v26.8,50.55
  other vias: 30.48,57.15 29.84,55.24 34.29,54.61 34.29,57.15 36.83,57.15 36.83,54.61
  pour Top (isolate 0.254, no thermals): 37.97,52.83 27.56,52.83 27.56,58.42 37.97,58.42
  pour Bottom (isolate 0.254, no thermals): 37.97,52.83 27.56,52.83 27.56,58.42 37.97,58.42

### Text on the board
Top: TOP
tNames: B | G | DIY Cellphone (08/08/2013) | David A. Mellis, mellis@media.mit.edu | High-Low Tech, MIT Media Lab
bNames: uC | Cell | uC | Cell
tValues: Cell | uC